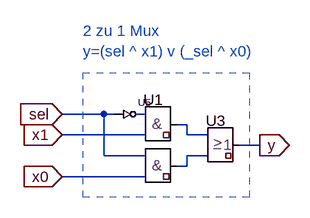
[diagram p0: schematic Draft6.asc]
Draft6.asc, the LTspice schematic file:
Version 4
SHEET 1 880 680
WIRE 80 96 16 96
WIRE 96 96 80 96
WIRE 144 96 128 96
WIRE 208 112 192 112
WIRE 144 128 16 128
WIRE 208 128 208 112
WIRE 240 128 208 128
WIRE 320 144 288 144
WIRE 80 160 80 96
WIRE 144 160 80 160
WIRE 240 160 208 160
WIRE 208 176 208 160
WIRE 208 176 192 176
WIRE 144 192 16 192
FLAG 16 96 sel
IOPIN 16 96 In
FLAG 16 192 x0
IOPIN 16 192 In
FLAG 16 128 x1
IOPIN 16 128 In
FLAG 320 144 y
IOPIN 320 144 Out
SYMBOL MDB_sym\\AND2s 160 112 R0
SYMATTR InstName U1
SYMBOL MDB_sym\\AND2s 160 176 R0
WINDOW 0 -19 -38 Invisible 2
SYMATTR InstName U2
SYMBOL MDB_sym\\OR2s 256 144 R0
SYMATTR InstName U3
SYMBOL MDB_sym\\inv4 80 32 R0
SYMATTR InstName U5
TEXT 48 -32 Left 2 ;2 zu 1 Mux\ny=(sel ^ x1) v (_sel ^ x0)
RECTANGLE Normal 304 224 48 32 2

The netlist it stands for:
* Draft6.asc
XU1 N001 x1 NC_01 N002 AND_2 TD=10n  ; pins in1 in2 _Q Q
XU2 sel x0 NC_02 N003 AND_2 TD=10n  ; pins in1 in2 _Q Q
XU3 N002 N003 NC_03 y or_2 TD=10n  ; pins in1 in2 _Q Q
XU5 sel N001 inv_mdb_nodelay Rout=10  ; pins in _Q
* 2 zu 1 Mux
* y=(sel ^ x1) v (_sel ^ x0)
.lib EIT_sub\or_and_gates.sub
.lib MDB_sub\inverter.sub
.backanno
.end